# EAGLE design IRBoardV1 (EAGLE 5.12)
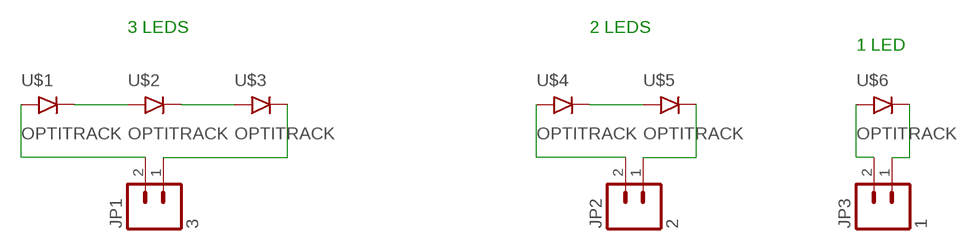
[diagram p0: schematic, sheet 1]

## Parts
JP1  3  M02JST-PH-SMD  [JST-2-PH-SMD]
JP2  2  M02JST-PH-SMD  [JST-2-PH-SMD]
JP3  1  M02JST-PH-SMD  [JST-2-PH-SMD]
U$1  OPTITRACK  [OPTITRACK]
U$2  OPTITRACK  [OPTITRACK]
U$3  OPTITRACK  [OPTITRACK]
U$4  OPTITRACK  [OPTITRACK]
U$5  OPTITRACK  [OPTITRACK]
U$6  OPTITRACK  [OPTITRACK]

## Nets
N$1: U$1.C U$2.A
N$2: U$2.C U$3.A
N$3: JP1.2 U$1.A
N$4: JP1.1 U$3.C
N$5: JP2.2 U$4.A
N$6: JP2.1 U$5.C
N$7: U$4.C U$5.A
N$8: JP3.2 U$6.A
N$9: JP3.1 U$6.C

## Notes on the sheet
- 3 LEDS | 2 LEDS
- 1 LED

## Library data of the parts
JP1-JP3 = GibbotV5:M02: Header 2 Standard 2-pin 0.1" header. Use with straight break away headers (SKU : PRT-00116), right angle break away headers (PRT-00553), swiss pins (PRT-00743), machine pins (PRT-00117), and female headers (PRT-00115). Molex polarized connector foot print use with SKU : PRT-08233 with associated crimp pins and housings.
U$1-U$6 = GibbotV6:OPTITRACK

## Board
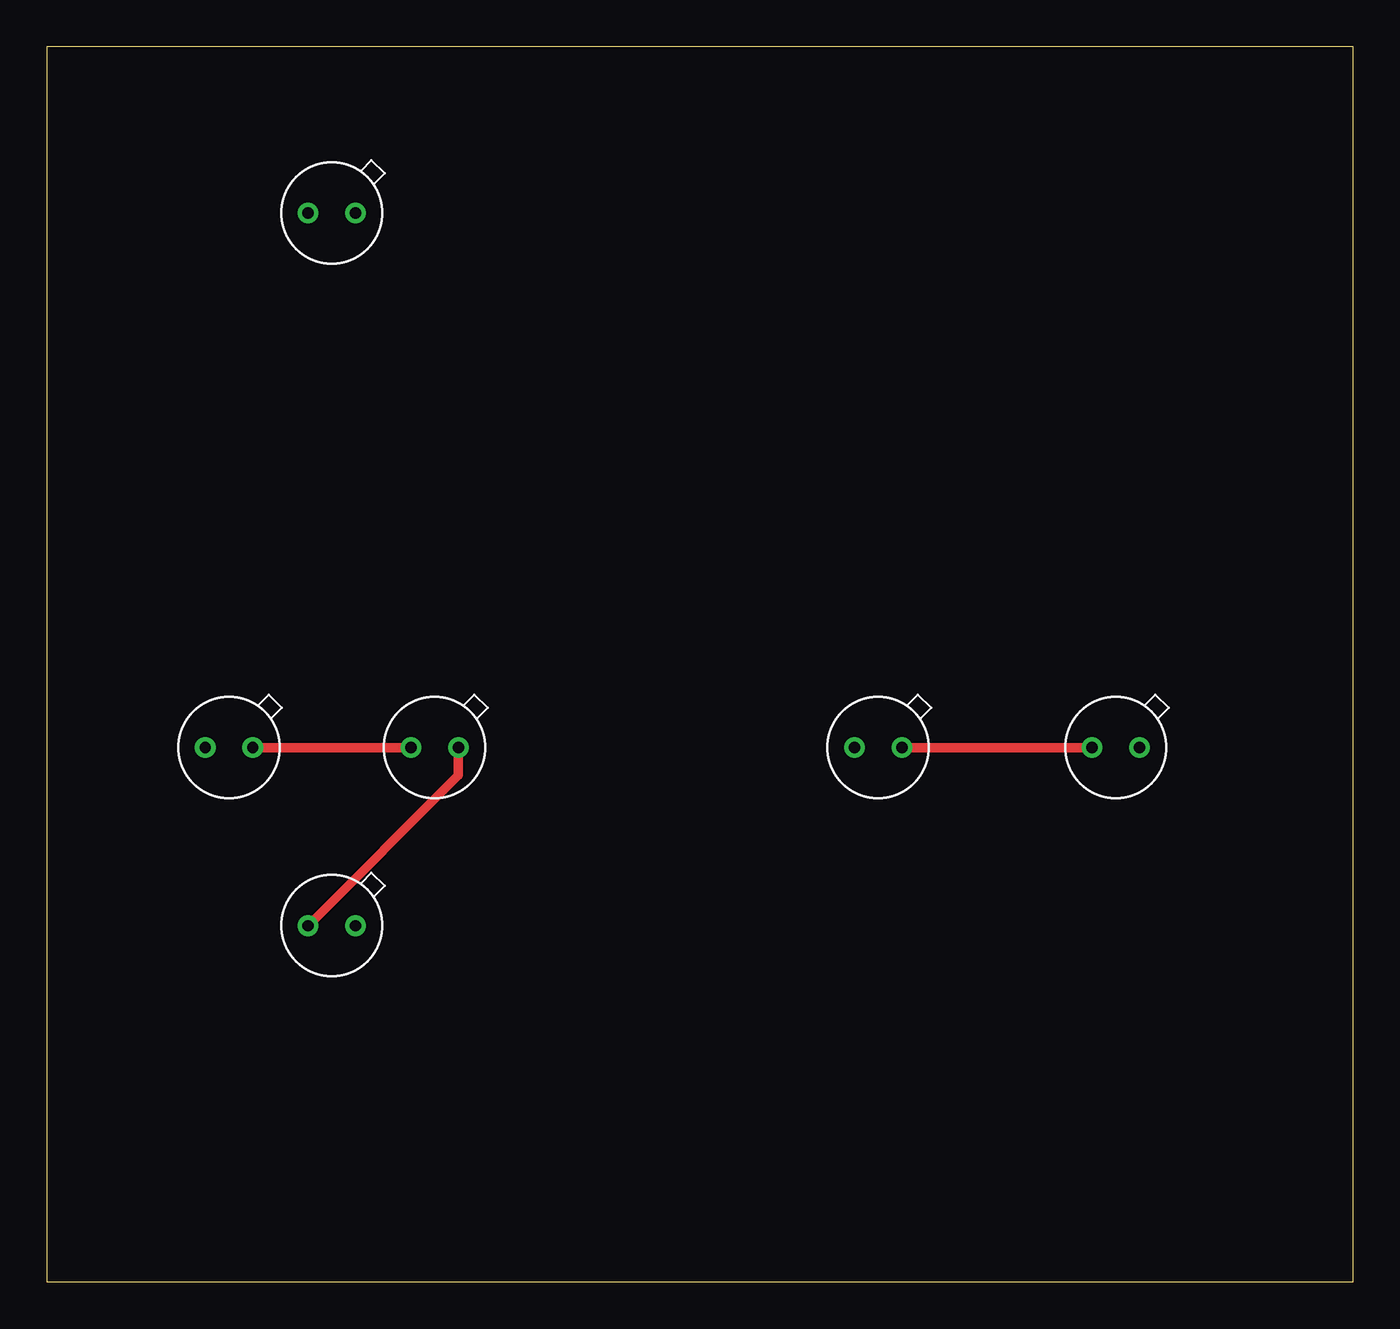
[diagram p1: board, top side]
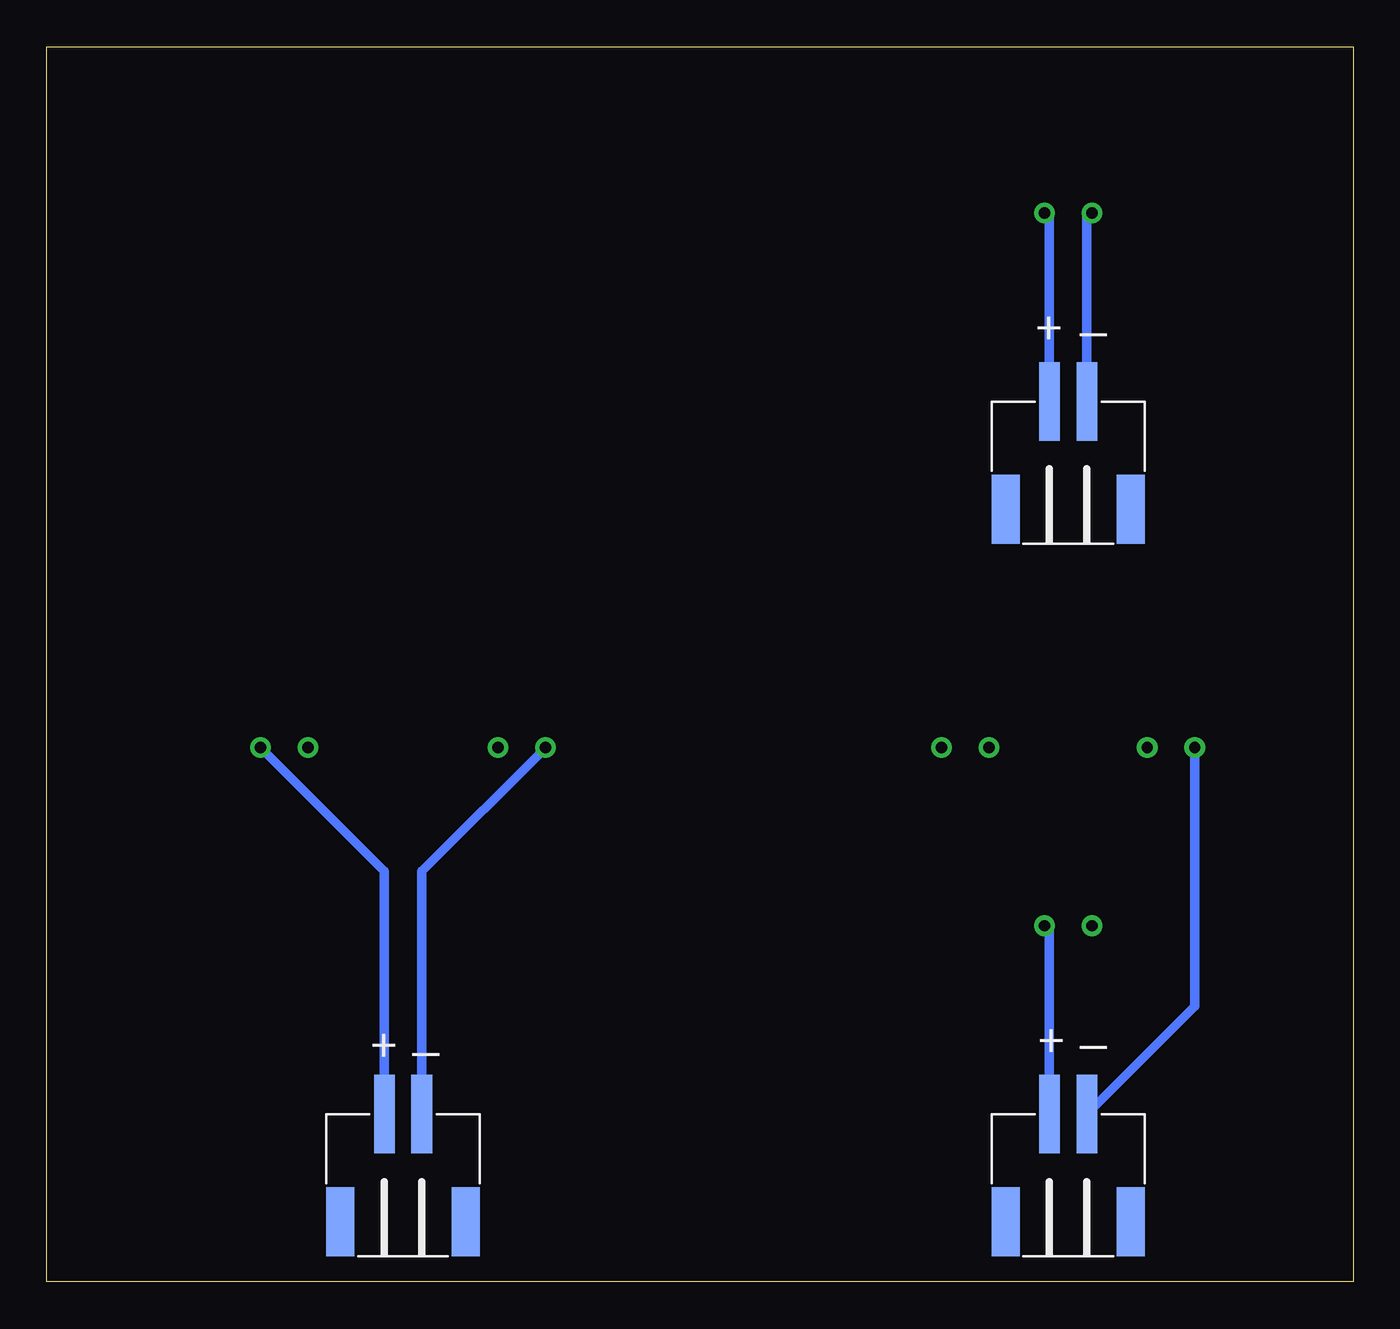
[diagram p2: board, bottom side, seen from below]

Size 69.85 x 66.04 mm. Coordinates in mm from the lower left corner, seen from the top.
Outline: 0,0 69.85,0 69.85,66.04 0,66.04 0,0
Copper layers (1*16): Top 0.035mm / dielectric 1.5mm / Bottom 0.035mm
Design rules "default": minimum track width 10mil, minimum drill 24mil, track to track 8mil, track to pad 8mil, pad to pad 8mil, via to via 8mil, smd to smd 8mil, copper to edge 40mil, drill to drill 8mil, minimum pad ring 10mil, minimum via ring 8mil, stop-mask expansion 4mil, vias tented up to drill 0mil, thermal gap 10mil

### Footprints (pad centres in the part's own frame; a part is rotated, then mirrored left to right if it is on the bottom)
JST-2-PH-SMD = smd 1.1 x 4.2: 1 -1,-7.7; 2 1,-7.7 | smd 1.5 x 3.7: P$1 -3.35,-1.95; P$4 3.35,-1.95
OPTITRACK = drill 0.6 round: A 1.27,0; C -1.27,0

### Placement (x,y rotation side)
JP1  15.24,1.27 180 bottom
JP2  50.8,1.27 180 bottom
JP3  15.24,39.37 180 bottom
U$1  15.24,19.05 0 top
U$2  20.74,28.57 0 top
U$3  9.74,28.57 0 top
U$4  57.15,28.57 0 top
U$5  44.45,28.57 0 top
U$6  15.24,57.15 0 top

### Tracks (layer width: path | path; a pad name or v marks a point on that pad's centre or on a via)
N$1
  Top 0.508: U$1.C 22.01,27.09 U$2.A
N$2
  Top 0.508: U$3.A U$2.C
N$3
  Bottom 0.508: JP1.2 16.24,18.78 U$1.A
N$4
  Bottom 0.508: JP1.1 8.47,14.74 U$3.C
N$5
  Bottom 0.508: JP2.2 51.8,21.95 U$4.A
N$6
  Bottom 0.508: JP2.1 49.8,21.95 U$5.C
N$7
  Top 0.508: U$5.A U$4.C
N$8
  Bottom 0.508: JP3.2 16.24,56.88 U$6.A
N$9
  Bottom 0.508: JP3.1 14.24,56.88 U$6.C

### Text on the board
bPlace: _ | + | _ | _ | + | +